# EAGLE design ElectronOnAStick-V1 (EAGLE 7.4.0)
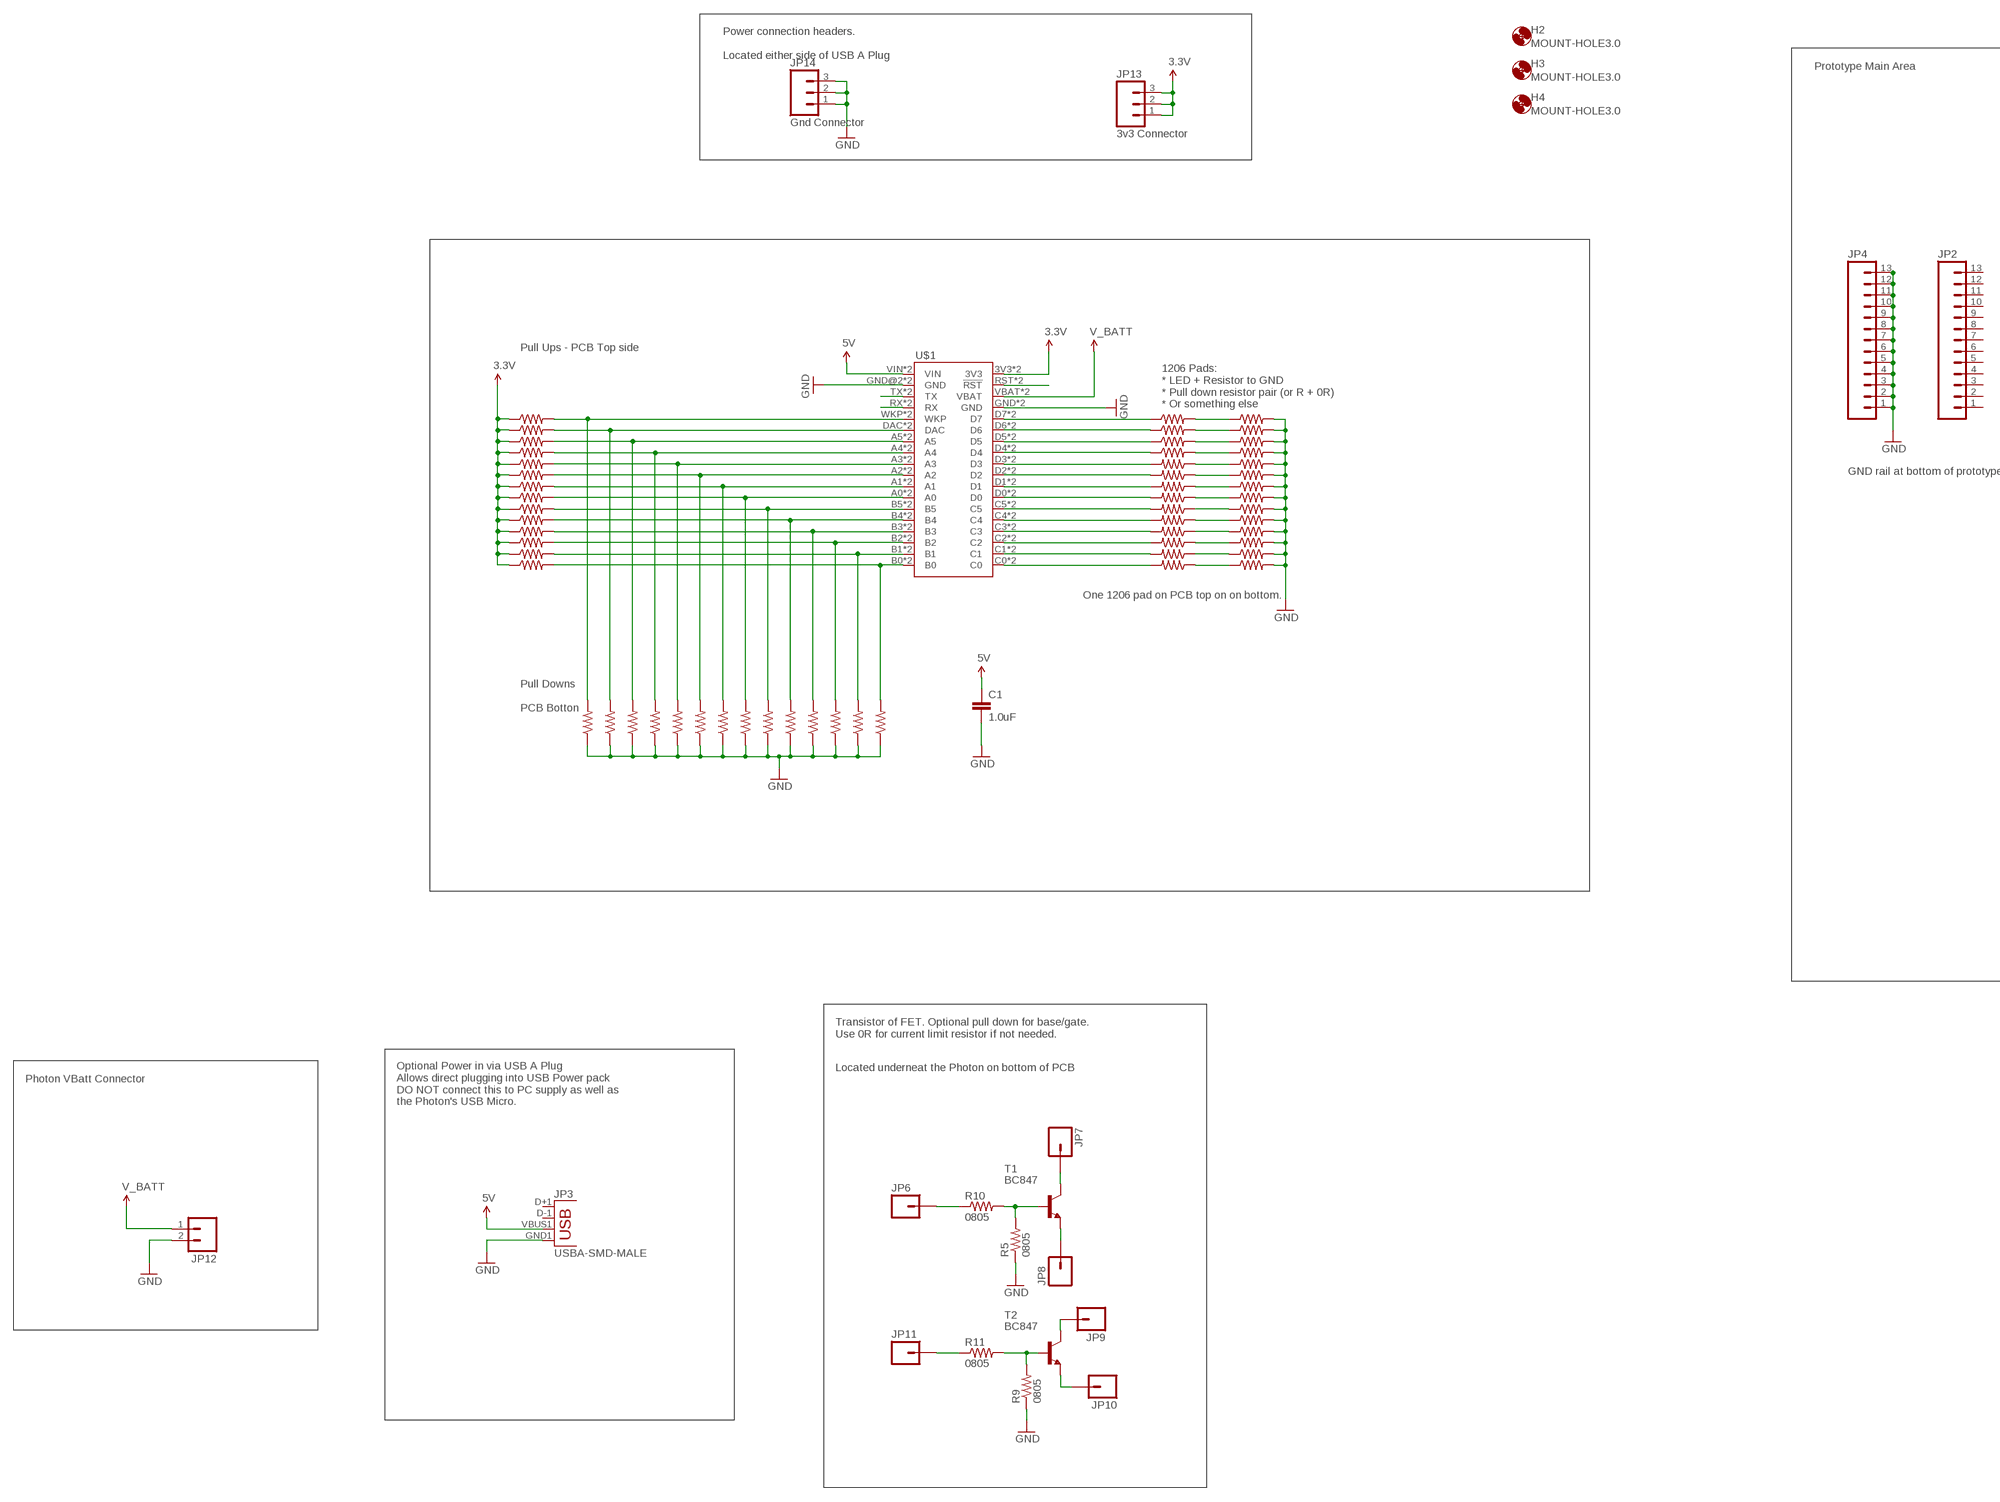
[diagram p0: schematic, sheet 1, part 1 of 2]
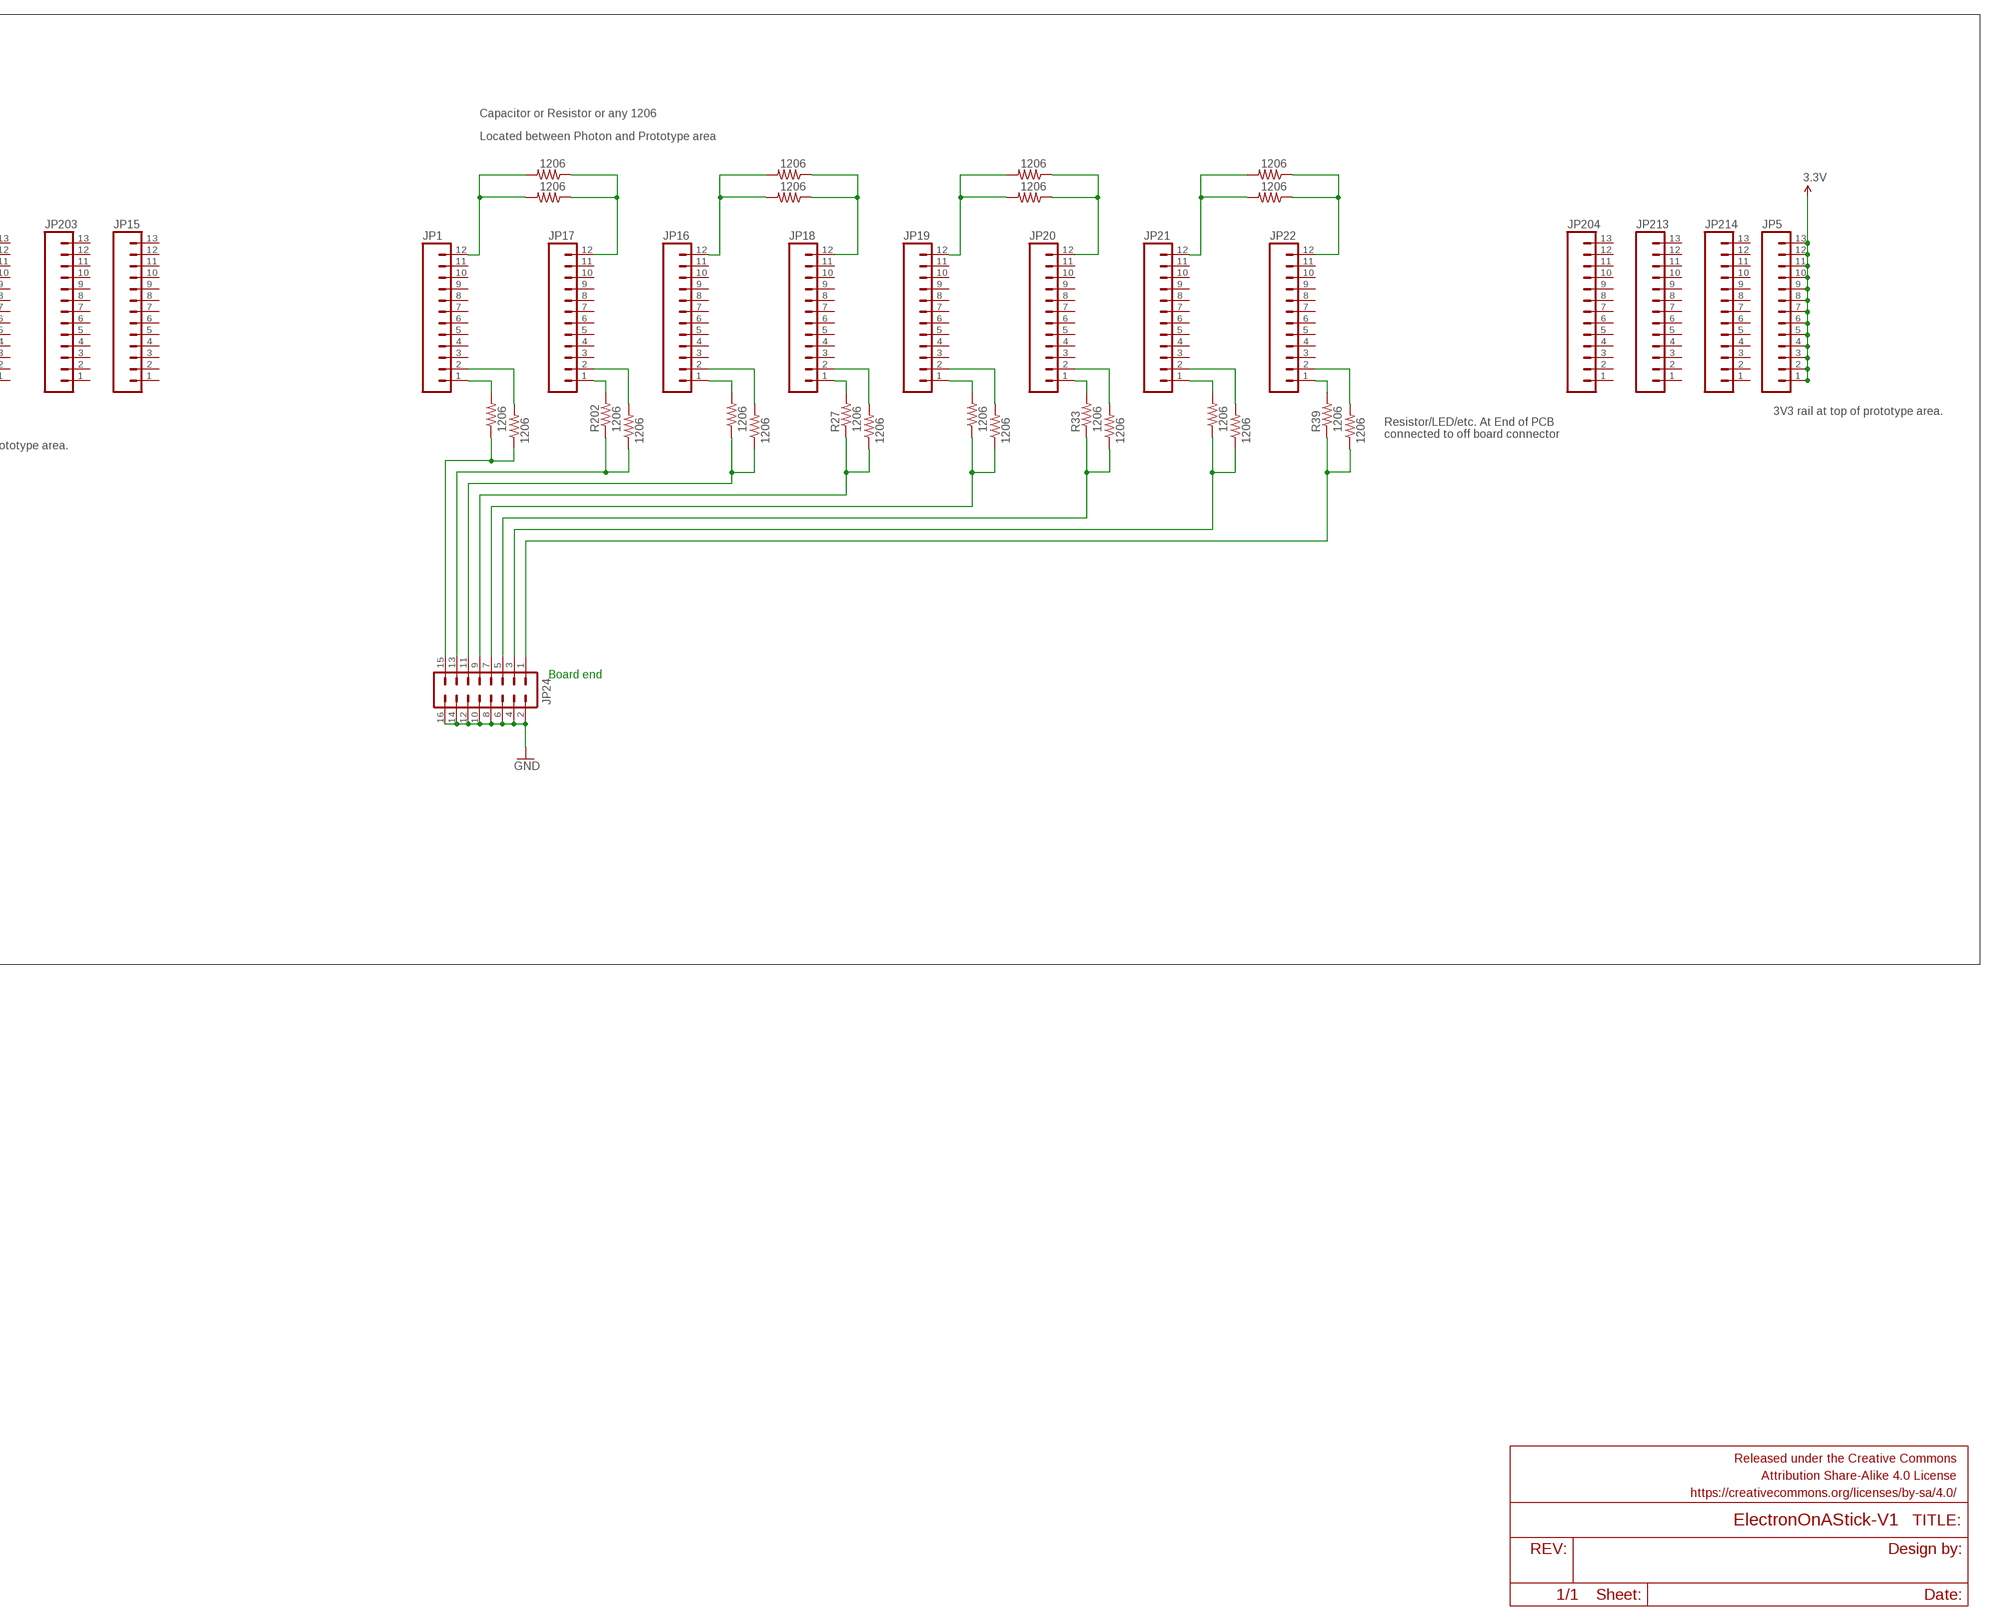
[diagram p1: schematic, sheet 1, part 2 of 2]

## Parts
C1  1.0uF  1.0UF-25V-+80/-20(0805)"  [0805-CAP]
FRAME1  FRAME-LEDGER  [CREATIVE_COMMONS]
H2  MOUNT-HOLE3.0  [3,0]
H3  MOUNT-HOLE3.0  [3,0]
H4  MOUNT-HOLE3.0  [3,0]
JP1  M12PTH  [1X12]
JP2  M13  [1X13]
JP3  USBA-SMD-MALE  [USB-A-SMT-MALE]
JP4  M13  [1X13]
JP5  M13  [1X13]
JP6  M01PTH  [1X01]
JP7  M01PTH  [1X01]
JP8  M01PTH  [1X01]
JP9  M01PTH  [1X01]
JP10  M01PTH  [1X01]
JP11  M01PTH  [1X01]
JP12  M02JST-PTH-2  [JST-2-PTH]
JP13  3v3 Connector  M03PTH  [1X03]
JP14  Gnd Connector  M03PTH  [1X03]
JP15  M13  [1X13]
JP16  M12PTH  [1X12]
JP17  M12PTH  [1X12]
JP18  M12PTH  [1X12]
JP19  M12PTH  [1X12]
JP20  M12PTH  [1X12]
JP21  M12PTH  [1X12]
JP22  M12PTH  [1X12]
JP24  M08X2  [2X8]
JP203  M13  [1X13]
JP204  M13  [1X13]
JP213  M13  [1X13]
JP214  M13  [1X13]
R1  1206  RESISTOR1206  [1206]
R2  1206  RESISTOR1206  [1206]
R3  1206  RESISTOR1206  [1206]
R4  1206  RESISTOR1206  [1206]
R5  0805  RESISTOR0805-RES  [0805]
R6  1206  RESISTOR1206  [1206]
R7  1206  RESISTOR1206  [1206]
R8  1206  RESISTOR1206  [1206]
R9  0805  RESISTOR0805-RES  [0805]
R10  0805  RESISTOR0805-RES  [0805]
R11  0805  RESISTOR0805-RES  [0805]
R12  1206  RESISTOR1206  [1206]
R13  1206  RESISTOR1206  [1206]
R14  1206  RESISTOR1206  [1206]
R15  1206  RESISTOR1206  [1206]
R16  1206  RESISTOR1206  [1206]
R17  1206  RESISTOR1206  [1206]
R18  1206  RESISTOR1206  [1206]
R19  1206  RESISTOR1206  [1206]
R20  1206  RESISTOR1206  [1206]
R21  1206  RESISTOR1206  [1206]
R22  1206  RESISTOR1206  [1206]
R23  1206  RESISTOR1206  [1206]
R24  1206  RESISTOR1206  [1206]
R25  1206  RESISTOR1206  [1206]
R26  1206  RESISTOR1206  [1206]
R27  1206  RESISTOR1206  [1206]
R28  1206  RESISTOR1206  [1206]
R29  1206  RESISTOR1206  [1206]
R30  1206  RESISTOR1206  [1206]
R31  1206  RESISTOR1206  [1206]
R32  1206  RESISTOR1206  [1206]
R33  1206  RESISTOR1206  [1206]
R34  1206  RESISTOR1206  [1206]
R35  1206  RESISTOR1206  [1206]
R36  1206  RESISTOR1206  [1206]
R37  1206  RESISTOR1206  [1206]
R38  1206  RESISTOR1206  [1206]
R39  1206  RESISTOR1206  [1206]
R40  1206  RESISTOR1206  [1206]
R41  1206  RESISTOR1206  [1206]
R42  1206  RESISTOR1206  [1206]
R43  1206  RESISTOR1206  [1206]
R44  1206  RESISTOR1206  [1206]
R45  1206  RESISTOR1206  [1206]
R46  1206  RESISTOR1206  [1206]
R47  1206  RESISTOR1206  [1206]
R48  1206  RESISTOR1206  [1206]
R49  1206  RESISTOR1206  [1206]
R50  1206  RESISTOR1206  [1206]
R51  1206  RESISTOR1206  [1206]
R52  1206  RESISTOR1206  [1206]
R53  1206  RESISTOR1206  [1206]
R54  1206  RESISTOR1206  [1206]
R55  1206  RESISTOR1206  [1206]
R56  1206  RESISTOR1206  [1206]
R57  1206  RESISTOR1206  [1206]
R58  1206  RESISTOR1206  [1206]
R59  1206  RESISTOR1206  [1206]
R60  1206  RESISTOR1206  [1206]
R61  1206  RESISTOR1206  [1206]
R62  1206  RESISTOR1206  [1206]
R63  1206  RESISTOR1206  [1206]
R64  1206  RESISTOR1206  [1206]
R65  1206  RESISTOR1206  [1206]
R66  1206  RESISTOR1206  [1206]
R67  1206  RESISTOR1206  [1206]
R68  1206  RESISTOR1206  [1206]
R69  1206  RESISTOR1206  [1206]
R70  1206  RESISTOR1206  [1206]
R201  1206  RESISTOR1206  [1206]
R202  1206  RESISTOR1206  [1206]
R313  1206  RESISTOR1206  [1206]
R314  1206  RESISTOR1206  [1206]
R315  1206  RESISTOR1206  [1206]
R316  1206  RESISTOR1206  [1206]
R317  1206  RESISTOR1206  [1206]
R318  1206  RESISTOR1206  [1206]
R319  1206  RESISTOR1206  [1206]
R320  1206  RESISTOR1206  [1206]
R410  1206  RESISTOR1206  [1206]
R411  1206  RESISTOR1206  [1206]
R412  1206  RESISTOR1206  [1206]
R413  1206  RESISTOR1206  [1206]
T1  BC847  [SOT23]
T2  BC847  [SOT23]
U$1  ELECTRONDUALNAMED  [ELECTRON_SIMPLE_SILK_NAMES_DUAL]

## Nets
3.3V: JP5.1 JP5.2 JP5.3 JP5.4 JP5.5 JP5.6 JP5.7 JP5.8 JP5.9 JP5.10 JP5.11 JP5.12 JP5.13 JP13.1 JP13.2 JP13.3 R1.1 R2.1 R3.1 R4.1 R6.1 R7.1 R12.1 R45.1 R46.1 R47.1 R48.1 R49.1 R67.1 R68.1 U$1.3V3 U$1.3V3_1(3V3)
5V: C1.1 JP3.VBUS1(VBUS) U$1.VIN U$1.VIN_1B(VIN)
GND: C1.2 JP3.GND1(GND) JP4.1 JP4.2 JP4.3 JP4.4 JP4.5 JP4.6 JP4.7 JP4.8 JP4.9 JP4.10 JP4.11 JP4.12 JP4.13 JP12.2 JP14.1 JP14.2 JP14.3 JP24.2 JP24.4 JP24.6 JP24.8 JP24.10 JP24.12 JP24.14 JP24.16 R5.1 R8.1 R9.1 R13.1 R14.1 R15.2 R16.2 R17.2 R18.2 R19.1 R20.1 R21.1 R22.1 R50.1 R51.1 R52.1 R53.1 R54.1 R55.2 R56.2 R57.2 R58.2 R59.2 R60.2 R69.1 R70.1 R410.2 R411.2 R412.2 R413.2 U$1.GND U$1.GND@2(GND) U$1.GND_1(GND) U$1.GND_1B(GND)
N$1: JP6.1 R10.1
N$2: JP17.1 R202.2
N$3: JP1.1 R201.2
N$4: U$1.RST(!RST) U$1.RST_1(!RST)
N$6: R8.2 R12.2 U$1.A5 U$1.A5_1(A5)
N$7: R49.2 R54.2 U$1.B0 U$1.B0_1(B0)
N$8: R1.2 R13.2 U$1.A4 U$1.A4_1(A4)
N$9: R2.2 R14.2 U$1.A3 U$1.A3_1(A3)
N$10: R48.2 R53.2 U$1.B1 U$1.B1_1(B1)
N$11: R22.2 R47.2 U$1.B2 U$1.B2_1(B2)
N$12: R320.1 U$1.D7 U$1.D7_1(D7)
N$13: R46.2 R52.2 U$1.B3 U$1.B3_1(B3)
N$14: JP24.15 R23.1 R201.1
N$15: R5.2 R10.2 T1.1(B)
N$16: R319.1 U$1.D6 U$1.D6_1(D6)
N$17: R318.1 U$1.D5 U$1.D5_1(D5)
N$18: R317.1 U$1.D4 U$1.D4_1(D4)
N$19: R316.2 U$1.D3 U$1.D3_1(D3)
N$20: R315.2 U$1.D2 U$1.D2_1(D2)
N$21: R314.2 U$1.D1 U$1.D1_1(D1)
N$22: JP1.2 R23.2
N$23: JP1.12 R24.2 R25.2
N$24: R45.2 R51.2 U$1.B4 U$1.B4_1(B4)
N$25: R320.2 R410.1
N$26: JP17.12 R24.1 R25.1
N$27: JP17.2 R26.2
N$28: JP24.13 R26.1 R202.1
N$29: JP18.1 R27.2
N$30: JP16.1 R28.2
N$31: JP24.11 R28.1 R29.1
N$32: JP16.2 R29.2
N$33: JP16.12 R30.2 R31.2
N$34: JP18.12 R30.1 R31.1
N$35: JP18.2 R32.2
N$36: JP24.9 R27.1 R32.1
N$37: JP20.1 R33.2
N$38: R7.2 R50.2 U$1.B5 U$1.B5_1(B5)
N$39: R313.2 U$1.D0 U$1.D0_1(D0)
N$40: JP19.1 R34.2
N$41: JP7.1 T1.3(C)
N$43: JP24.7 R34.1 R35.1
N$44: R18.1 R313.1
N$45: R17.1 R314.1
N$46: R16.1 R315.1
N$47: R15.1 R316.1
N$48: R317.2 R413.1
N$49: R318.2 R412.1
N$50: R319.2 R411.1
N$52: JP19.2 R35.2
N$53: JP19.12 R36.2 R37.2
N$54: JP20.12 R36.1 R37.1
N$55: JP8.1 T1.2(E)
N$56: JP20.2 R38.2
N$57: JP24.5 R33.1 R38.1
N$58: JP22.1 R39.2
N$59: JP11.1 R11.1
N$60: R9.2 R11.2 T2.1(B)
N$61: JP9.1 T2.3(C)
N$62: JP10.1 T2.2(E)
N$63: JP21.1 R40.2
N$64: JP24.3 R40.1 R41.1
N$65: JP21.2 R41.2
N$68: JP21.12 R42.2 R43.2
N$69: JP22.12 R42.1 R43.1
N$70: JP22.2 R44.2
N$72: JP24.1 R39.1 R44.1
N$73: R6.2 R21.2 U$1.A0 U$1.A0_1(A0)
N$74: R4.2 R20.2 U$1.A1 U$1.A1_1(A1)
N$75: R3.2 R19.2 U$1.A2 U$1.A2_1(A2)
N$76: R55.1 R61.1
N$77: R56.1 R62.1
N$78: R57.1 R63.1
N$79: R58.1 R64.1
N$80: R59.1 R65.1
N$81: R60.1 R66.1
N$82: R61.2 U$1.C5 U$1.C5_1(C5)
N$83: R62.2 U$1.C4 U$1.C4_1(C4)
N$84: R63.2 U$1.C3 U$1.C3_1(C3)
N$85: R64.2 U$1.C2 U$1.C2_1(C2)
N$86: R65.2 U$1.C1 U$1.C1_1(C1)
N$87: R66.2 U$1.C0 U$1.C0_1(C0)
N$89: U$1.TX U$1.TX_1(TX)
N$91: U$1.RX U$1.RX_1(RX)
N$92: R68.2 R70.2 U$1.WKP U$1.WKP_1(WKP)
N$93: R67.2 R69.2 U$1.DAC U$1.DAC_1(DAC)
V_BATT: JP12.1 U$1.VBAT U$1.VBATT_1(VBAT)
Unconnected: JP1.3 JP1.4 JP1.5 JP1.6 JP1.7 JP1.8 JP1.9 JP1.10 JP1.11 JP2.1 JP2.2 JP2.3 JP2.4 JP2.5 JP2.6 JP2.7 JP2.8 JP2.9 JP2.10 JP2.11 JP2.12 JP2.13 JP3.D+1(D+) JP3.D-1(D-) JP15.1 JP15.2 JP15.3 JP15.4 JP15.5 JP15.6 JP15.7 JP15.8 JP15.9 JP15.10 JP15.11 JP15.12 JP15.13 JP16.3 JP16.4 JP16.5 JP16.6 JP16.7 JP16.8 JP16.9 JP16.10 JP16.11 JP17.3 JP17.4 JP17.5 JP17.6 JP17.7 JP17.8 JP17.9 JP17.10 JP17.11 JP18.3 JP18.4 JP18.5 JP18.6 JP18.7 JP18.8 JP18.9 JP18.10 JP18.11 JP19.3 JP19.4 JP19.5 JP19.6 JP19.7 JP19.8 JP19.9 JP19.10 JP19.11 JP20.3 JP20.4 JP20.5 JP20.6 JP20.7 JP20.8 JP20.9 JP20.10 JP20.11 JP21.3 JP21.4 JP21.5 JP21.6 JP21.7 JP21.8 JP21.9 JP21.10 JP21.11 JP22.3 JP22.4 JP22.5 JP22.6 JP22.7 JP22.8 JP22.9 JP22.10 JP22.11 JP203.1 JP203.2 JP203.3 JP203.4 JP203.5 JP203.6 JP203.7 JP203.8 JP203.9 JP203.10 JP203.11 JP203.12 JP203.13 JP204.1 JP204.2 JP204.3 JP204.4 JP204.5 JP204.6 JP204.7 JP204.8 JP204.9 JP204.10 JP204.11 JP204.12 JP204.13 JP213.1 JP213.2 JP213.3 JP213.4 JP213.5 JP213.6 JP213.7 JP213.8 JP213.9 JP213.10 JP213.11 JP213.12 JP213.13 JP214.1 JP214.2 JP214.3 JP214.4 JP214.5 JP214.6 JP214.7 JP214.8 JP214.9 JP214.10 JP214.11 JP214.12 JP214.13

## Notes on the sheet
- Power connection headers.
  
  Located either side of USB A Plug
- Prototype Main Area
- Capacitor or Resistor or any 1206
- Located between Photon and Prototype area
- Pull Ups - PCB Top side
- 1206 Pads:
  * LED + Resistor to GND
  * Pull down resistor pair (or R + 0R)
  * Or something else
- 3V3 rail at top of prototype area.
- Resistor/LED/etc. At End of PCB 
  connected to off board connector
- GND rail at bottom of prototype area.
- One 1206 pad on PCB top on on bottom.
- Board end
- Pull Downs
  
  PCB Botton
- Transistor of FET. Optional pull down for base/gate.
  Use 0R for current limit resistor if not needed.
- Located underneat the Photon on bottom of PCB
- Photon VBatt Connector
- Optional Power in via USB A Plug
  Allows direct plugging into USB Power pack
  DO NOT connect this to PC supply as well as
  the Photon's USB Micro.

## Library data of the parts
C1 = SparkFun-Capacitors:1.0UF-25V-+80/-20(0805): CAP-11625; PROD_ID: CAP-11625
FRAME1 = SparkFun-Aesthetics:FRAME-LEDGER: Schematic Frame Standard 11x14 US Ledger frame
H2-H4 = holes:MOUNT-HOLE: MOUNTING HOLE with drill center marker
JP1 JP16-JP22 = SparkFun-Connectors:M12: Header 12 Standard 12-pin 0.1" header. Use with straight break away headers (SKU : PRT-00116), right angle break away headers (PRT-00553), swiss pins (PRT-00743), machine pins (PRT-00117), and female headers (PRT-00115).
JP2 JP4 JP5 JP15 JP203 JP204 JP213 JP214 = SparkFun-Connectors:M13: 13-pin single row .1" header
JP3 = SparkFun-Connectors:USB: USB Connectors USB-B-PTH is fully proven SKU : PRT-00139/CONN-08278 USB-miniB is fully proven SKU : PRT-00587 USB-A-PCB is untested. USB-A-H is throughly reviewed, but untested. Spark Fun Electronics SKU : PRT-00437 USB-B-SMT is throughly reviewed, but untested. Needs silkscreen touching up. USB-A-S has not been used/tested USB-MB-H has not been used/tested USB-MICROB has been used. CONN-09505
JP6-JP11 = SparkFun-Connectors:M01: Header 1 Standard 1-pin 0.1" header. Use with straight break away headers (SKU : PRT-00116), right angle break away headers (PRT-00553), swiss pins (PRT-00743), machine pins (PRT-00117), and female headers (PRT-00115).
JP12 = SparkFun-Connectors:M02: Standard 2-pin 0.1" header. Use with - straight break away headers ( PRT-00116) - right angle break away headers (PRT-00553) - swiss pins (PRT-00743) - machine pins (PRT-00117) - female headers (PRT-00115) Molex polarized connector foot print use with: PRT-08233 with associated crimp pins and housings. 2.54_SCREWTERM for use with PRT-10571. 3.5mm Screw Terminal footprints for PRT-08084 5mm Screw Terminal footprints for use with PRT-08432; PROD_ID: CONN-09863; SKU: PRT-09914
JP13 JP14 = SparkFun-Connectors:M03: Header 3 Standard 3-pin 0.1" header. Use with straight break away headers (SKU : PRT-00116), right angle break away headers (PRT-00553), swiss pins (PRT-00743), machine pins (PRT-00117), and female headers (PRT-00115). Molex polarized connector foot print use with SKU : PRT-08232 with associated crimp pins and housings.
JP24 = SparkFun-Connectors:M08X2: .1" headers, two rows of 8 each
R1-R70 R201 R202 R313-R320 R410-R413 = SparkFun-Resistors:RESISTOR: Resistor Basic schematic elements and footprints for 0603, 1206, and PTH resistors.
T1 T2 = transistor-neu-to92:BC847: NPN TRANSISTOR
U$1 = Tinamous:ELECTRON

## Board
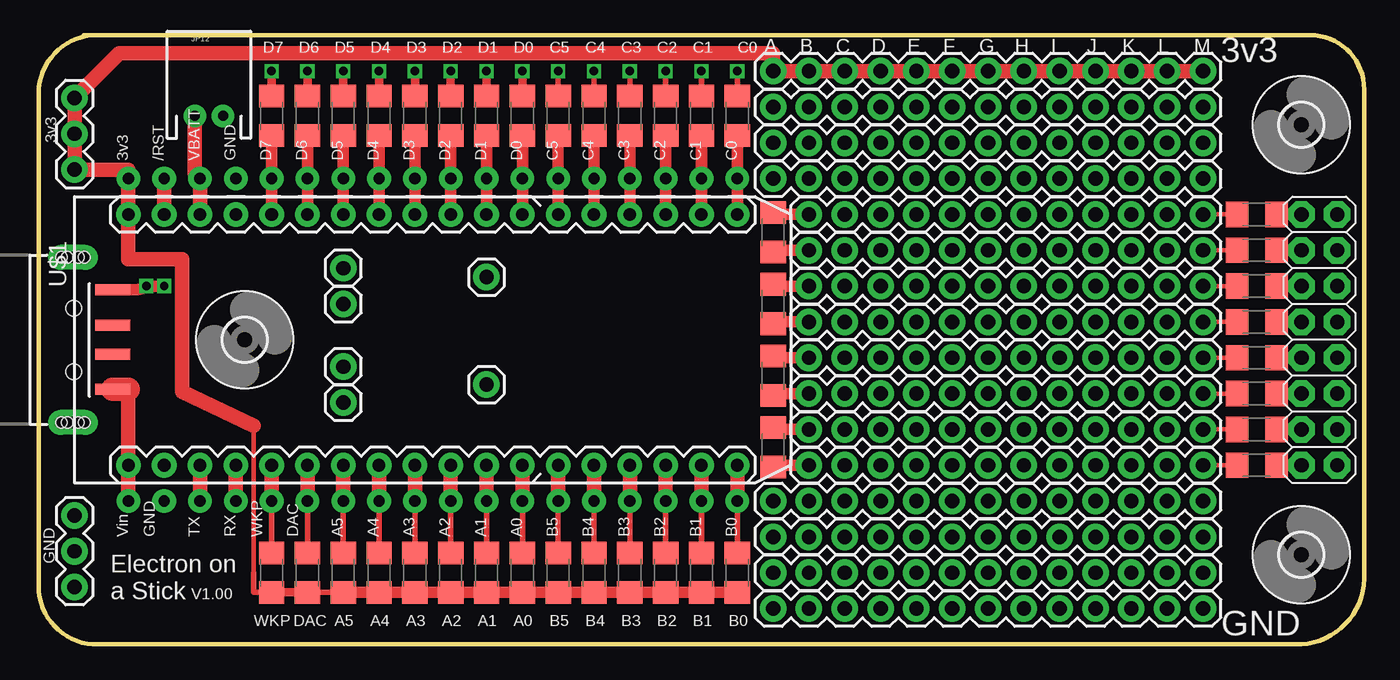
[diagram p2: board, top side]
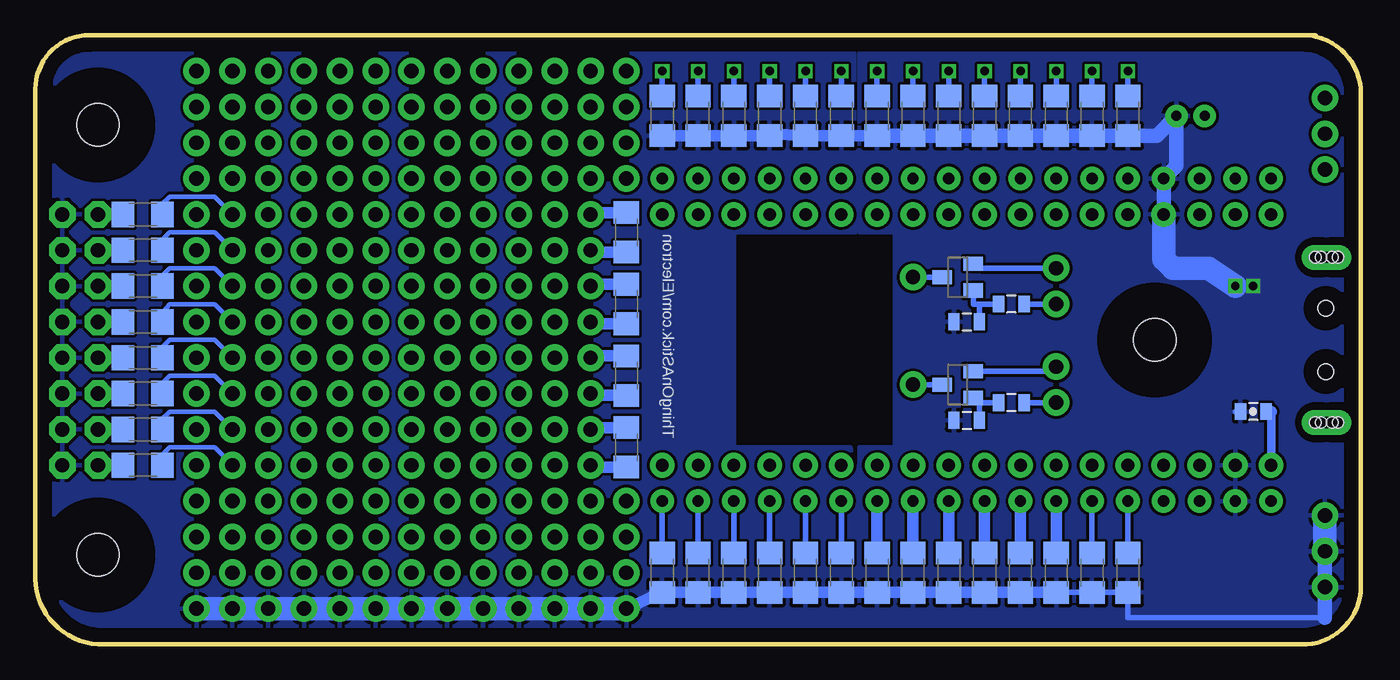
[diagram p3: board, bottom side, seen from below]

Size 94 x 43.18 mm. Coordinates in mm from the lower left corner, seen from the top.
Outline: 0.01,4.45 arc90 3.82,0 89.55,0 arc90 93.99,5.08 93.99,39.37 arc90 90.18,43.18 3.19,43.18
Outline: 0.01,4.06 0.01,38.73 arc-90 3.82,43.18
Copper layers (1*16): Top 0.035mm / dielectric 1.5mm / Bottom 0.035mm
Design rules "default": minimum track width 10mil, minimum drill 24mil, track to track 8mil, track to pad 8mil, pad to pad 8mil, via to via 8mil, smd to smd 8mil, copper to edge 40mil, drill to drill 8mil, minimum pad ring 10mil, minimum via ring 8mil, stop-mask expansion 4mil, vias tented up to drill 0mil, thermal gap 10mil

### Footprints (pad centres in the part's own frame; a part is rotated, then mirrored left to right if it is on the bottom)
0805-CAP = smd 0.8 x 1.2: 1 -0.9,0; 2 0.9,0
3,0 = hole 3: 0,0
1X12 = drill 1.016 pad 1.88: 1 0,0; 2 2.54,0; 3 5.08,0; 4 7.62,0; 5 10.16,0; 6 12.7,0; 7 15.24,0; 8 17.78,0; 9 20.32,0; 10 22.86,0; 11 25.4,0; 12 27.94,0
1X13 = drill 1.016 pad 1.88: 1 0,0; 2 2.54,0; 3 5.08,0; 4 7.62,0; 5 10.16,0; 6 12.7,0; 7 15.24,0; 8 17.78,0; 9 20.32,0; 10 22.86,0; 11 25.4,0; 12 27.94,0; 13 30.48,0
USB-A-SMT-MALE = smd 0.8 x 2.5: D+1 1.027,-5.87; D-1 -1.027,-5.87; GND1 3.551,-5.87; VBUS1 -3.5,-5.87 | drill 0.8 pad 1.778 long: P$1 5.85,-3.05; P$3 -5.85,-3.05 | hole 1.1: 2.25,-3.12; -2.25,-3.12 | hole 0.8: -5.85,-3.45; -5.85,-3.85; -5.85,-2.65; -5.85,-2.25; 5.85,-3.45; 5.85,-3.85; 5.85,-2.65; 5.85,-2.25
1X01 = drill 1.016 pad 1.88: 1 0,0
JST-2-PTH = drill 0.7 pad 1.6: 1 -1,0; 2 1,0
1X03 = drill 1.016 pad 1.88: 1 0,0; 2 2.54,0; 3 5.08,0
2X8 = drill 1.016 pad 1.88 octagon: 1 0,0; 2 0,2.54; 3 2.54,0; 4 2.54,2.54; 5 5.08,0; 6 5.08,2.54; 7 7.62,0; 8 7.62,2.54; 9 10.16,0; 10 10.16,2.54; 11 12.7,0; 12 12.7,2.54; 13 15.24,0; 14 15.24,2.54; 15 17.78,0; 16 17.78,2.54
1206 = smd 1.6 x 1.8: 1 -1.4,0; 2 1.4,0
0805 = smd 0.8 x 1.2: 1 -0.9,0; 2 0.9,0
SOT23 = smd 1 x 1.4: 1 -0.95,-1.1; 2 0.95,-1.1; 3 0,1.1
ELECTRON_SIMPLE_SILK_NAMES_DUAL = drill 0.889 pad 1.753: 3V3 1.27,22.86; A0 29.21,5.08; A1 26.67,5.08; A2 24.13,5.08; A3 21.59,5.08; A4 19.05,5.08; A5 16.51,5.08; B0 44.45,5.08; B1 41.91,5.08; B2 39.37,5.08; B3 36.83,5.08; B4 34.29,5.08; B5 31.75,5.08; C0 44.45,22.86; C1 41.91,22.86; C2 39.37,22.86; C3 36.83,22.86; C4 34.29,22.86; C5 31.75,22.86; D0 29.21,22.86; D1 26.67,22.86; D2 24.13,22.86; D3 21.59,22.86; D4 19.05,22.86; D5 16.51,22.86; D6 13.97,22.86; D7 11.43,22.86; DAC 13.97,5.08; GND 8.89,22.86; GND@2 3.81,5.08; RST 3.81,22.86; RX 8.89,5.08; TX 6.35,5.08; VBAT 6.35,22.86; VIN 1.27,5.08; WKP 11.43,5.08 | drill 0.8 pad 1.676: 3V3_1 1.27,25.4; A0_1 29.21,2.54; A1_1 26.67,2.54; A2_1 24.13,2.54; A3_1 21.59,2.54; A4_1 19.05,2.54; A5_1 16.51,2.54; B0_1 44.45,2.54; B1_1 41.91,2.54; B2_1 39.37,2.54; B3_1 36.83,2.54; B4_1 34.29,2.54; B5_1 31.75,2.54; C0_1 44.45,25.4; C1_1 41.91,25.4; C2_1 39.37,25.4; C3_1 36.83,25.4; C4_1 34.29,25.4; C5_1 31.75,25.4; D0_1 29.21,25.4; D1_1 26.67,25.4; D2_1 24.13,25.4; D3_1 21.59,25.4; D4_1 19.05,25.4; D5_1 16.51,25.4; D6_1 13.97,25.4; D7_1 11.43,25.4; DAC_1 13.97,2.54; GND_1 8.89,25.4; GND_1B 3.81,2.54; RST_1 3.81,25.4; RX_1 8.89,2.54; TX_1 6.35,2.54; VBATT_1 6.35,25.4; VIN_1B 1.27,2.54; WKP_1 11.43,2.54

### Placement (x,y rotation side)
C1  7.63,16.51 180 bottom
FRAME1  -5.07,-8.25 0 top  (outside the outline)
H2  14.62,21.59 0 top
H3  89.55,36.83 0 top
H4  89.55,6.35 0 top
JP1  82.56,12.7 180 top
JP2  82.56,38.1 180 top
JP3  -0.62,21.59 90 top
JP4  82.56,2.54 180 top
JP5  82.56,40.64 180 top
JP6  21.6,24.13 0 top
JP7  31.76,26.04 0 top
JP8  21.6,26.67 0 top
JP9  31.76,18.41 0 top
JP10  21.6,19.68 0 top
JP11  21.6,17.14 0 top
JP12  12.08,37.46 0 top
JP13  2.55,33.66 90 top
JP14  2.55,9.14 270 top
JP15  82.56,5.08 180 top
JP16  82.56,17.78 180 top
JP17  82.56,15.24 180 top
JP18  82.56,20.32 180 top
JP19  82.56,22.86 180 top
JP20  82.56,25.4 180 top
JP21  82.56,27.94 180 top
JP22  82.56,30.48 180 top
JP24  89.55,30.48 270 top
JP203  82.56,35.56 180 top
JP204  82.56,33.02 180 top
JP213  82.56,10.16 180 top
JP214  82.56,7.62 180 top
R1  24.14,5.08 90 top
R2  26.68,5.08 90 top
R3  29.22,5.08 90 top
R4  31.76,5.08 90 top
R5  27.95,22.86 0 bottom
R6  34.3,5.08 90 top
R7  36.84,5.08 90 top
R8  21.6,5.08 90 bottom
R9  27.95,15.88 0 bottom
R10  24.78,24.13 180 bottom
R11  24.78,17.14 180 bottom
R12  21.6,5.08 90 top
R13  24.14,5.08 90 bottom
R14  26.68,5.08 90 bottom
R15  26.68,37.46 270 bottom
R16  29.22,37.46 270 bottom
R17  31.76,37.46 270 bottom
R18  34.3,37.46 270 bottom
R19  29.22,5.08 90 bottom
R20  31.76,5.08 90 bottom
R21  34.3,5.08 90 bottom
R22  44.46,5.08 90 bottom
R23  86.37,12.7 0 bottom
R24  52.08,13.97 270 top
R25  52.08,13.97 270 bottom
R26  86.37,15.24 0 bottom
R27  86.37,20.32 180 top
R28  86.37,17.78 180 top
R29  86.37,17.78 0 bottom
R30  52.08,19.05 270 top
R31  52.08,19.05 270 bottom
R32  86.37,20.32 0 bottom
R33  86.37,25.4 180 top
R34  86.37,22.86 180 top
R35  86.37,22.86 0 bottom
R36  52.08,24.13 270 top
R37  52.08,24.13 270 bottom
R38  86.37,25.4 0 bottom
R39  86.37,30.48 180 top
R40  86.37,27.94 180 top
R41  86.37,27.94 0 bottom
R42  52.08,29.21 270 top
R43  52.08,29.21 270 bottom
R44  86.37,30.48 0 bottom
R45  39.38,5.08 90 top
R46  41.92,5.08 90 top
R47  44.46,5.08 90 top
R48  47,5.08 90 top
R49  49.54,5.08 90 top
R50  36.84,5.08 90 bottom
R51  39.38,5.08 90 bottom
R52  41.92,5.08 90 bottom
R53  47,5.08 90 bottom
R54  49.54,5.08 90 bottom
R55  36.84,37.46 270 bottom
R56  39.38,37.46 270 bottom
R57  41.92,37.46 270 bottom
R58  44.46,37.46 270 bottom
R59  47,37.46 270 bottom
R60  49.54,37.46 270 bottom
R61  36.84,37.46 270 top
R62  39.38,37.46 270 top
R63  41.92,37.46 270 top
R64  44.46,37.46 270 top
R65  47,37.46 270 top
R66  49.54,37.46 270 top
R67  19.06,5.08 90 top
R68  16.52,5.08 90 top
R69  19.06,5.08 90 bottom
R70  16.52,5.08 90 bottom
R201  86.37,12.7 180 top
R202  86.37,15.24 180 top
R313  34.3,37.46 270 top
R314  31.76,37.46 270 top
R315  29.22,37.46 270 top
R316  26.68,37.46 270 top
R317  24.14,37.46 90 top
R318  21.6,37.46 90 top
R319  19.06,37.46 90 top
R320  16.52,37.46 90 top
R410  16.52,37.46 270 bottom
R411  19.06,37.46 270 bottom
R412  21.6,37.46 270 bottom
R413  24.14,37.46 270 bottom
T1  28.59,26.04 90 bottom
T2  28.59,18.41 90 bottom
U$1  5.09,7.62 0 top

### Tracks (layer width: path | path; a pad name or v marks a point on that pad's centre or on a via)
3.3V
  Top 0.305: 15.25,4.18 15.25,5.08 15.25,15.49
  Top 0.406: R12.1 R67.1 | R68.1 15.25,3.68 15.25,5.08
  Top 0.61: R68.1 R67.1
  Top 0.813: R12.1 R1.1 R2.1 R3.1 R4.1 R6.1 R7.1 R45.1 R46.1 R47.1 R48.1 R49.1
  Top 1.016: 15.25,15.49 10.17,17.91 10.17,27.3 6.36,27.3 U$1.3V3 U$1.3V3_1 6.36,33.66 JP13.1 JP13.2 JP13.3 5.73,41.91 52.08,41.91 JP5.13 JP5.12 JP5.11 JP5.10 JP5.9 JP5.8 JP5.7 JP5.6 JP5.5 JP5.4 JP5.3 JP5.2 JP5.1
5V
  Top 1.016: U$1.VIN_1B U$1.VIN 6.36,18.09
  Top 1.676: JP3.VBUS1 6.36,18.09
  Bottom 0.61: 6.36,16.51 U$1.VIN
  Bottom 0.813: C1.1 6.36,16.51
GND  (via drill 0.6)
  Top 0.813: JP3.GND1 7,25.14 7,25.15 7.89,25.4 v8.9,25.4
  Bottom 0.406: C1.2 8.9,16.51 | 2.55,1.91 16.52,1.91 R70.1 R8.1
  Bottom 0.813: R8.1 R13.1 R14.1 R19.1 R20.1 R21.1 R50.1 R51.1 R52.1 R22.1 R53.1 R54.1 JP4.13 | R60.2 R59.2 R58.2 R57.2 41.92,36.2 R56.2 R55.2 R18.2
  Bottom 1.016: R18.2 R17.2 R16.2 R15.2 R413.2 R412.2 R411.2 R410.2 14.48,36.06 JP12.2 13.08,33.93 U$1.GND_1 13.98,30.35 | JP14.2 2.55,1.91
  Bottom 1.676: JP4.1 JP4.2 JP4.3 JP4.4 JP4.5 JP4.6 JP4.7 JP4.8 JP4.9 JP4.10 JP4.11 JP4.12 JP4.13 | 13.98,30.35 13.98,27.3 13.35,26.67 10.81,26.67 v8.9,25.4 | JP14.1 JP14.2
  other vias: 7.63,25.4
  pour Bottom: -3.16,-0.63 94.63,-0.63 95.26,44.45 35.95,44.45 35.83,29.21 44.46,29.21 44.46,13.97 36.21,13.97 35.57,11.43 35.57,13.97 33.03,13.97 33.03,29.21 35.57,29.21 35.57,44.45 -2.53,44.45
N$1
  Bottom 0.406: R10.1 JP6.1
N$2
  Top 0.305: R202.2 JP17.1
N$3
  Top 0.305: R201.2 JP1.1
N$4
  Top 1.016: U$1.RST U$1.RST_1
N$6
  Top 0.406: U$1.A5_1 R8.2
  Top 1.016: U$1.A5 U$1.A5_1
  Bottom 0.813: R8.2 U$1.A5_1
N$7
  Top 0.406: R54.2 U$1.B0_1
  Top 1.016: U$1.B0 U$1.B0_1
  Bottom 0.406: R54.2 U$1.B0_1
N$8
  Top 0.406: U$1.A4_1 R13.2
  Top 1.016: U$1.A4 U$1.A4_1
  Bottom 0.813: R13.2 U$1.A4_1
N$9
  Top 0.406: U$1.A3_1 R14.2
  Top 1.016: U$1.A3 U$1.A3_1
  Bottom 0.813: R14.2 U$1.A3_1
N$10
  Top 0.406: R53.2 U$1.B1_1
  Top 1.016: U$1.B1 U$1.B1_1
  Bottom 0.406: R53.2 U$1.B1_1
N$11
  Top 0.406: R22.2 U$1.B2_1
  Top 1.016: U$1.B2 U$1.B2_1
  Bottom 0.406: R22.2 U$1.B2_1
N$12
  Top 0.813: U$1.D7 U$1.D7_1 R320.1
N$13
  Top 0.406: R52.2 U$1.B3_1
  Top 1.016: U$1.B3 U$1.B3_1
  Bottom 0.406: R52.2 U$1.B3_1
N$14
  Top 0.305: R23.1 JP24.15
  Bottom 0.305: R23.1 JP24.15
N$15
  Bottom 0.406: R10.2 27.05,24.13 | T1.1 27.49,24.13 27.05,24.13 | 27.05,24.13 R5.2
N$16
  Top 0.813: R319.1 U$1.D6_1 U$1.D6
N$17
  Top 0.813: U$1.D5 U$1.D5_1 R318.1
N$18
  Top 0.813: R317.1 U$1.D4_1 U$1.D4
N$19
  Top 0.813: U$1.D3 U$1.D3_1 R316.2
N$20
  Top 0.813: R315.2 U$1.D2_1 U$1.D2
N$21
  Top 0.813: U$1.D1 U$1.D1_1 R314.2
N$22
  Bottom 0.305: JP1.2 81.29,13.97 84.47,13.97 85.1,13.34 85.1,12.83 R23.2
N$23
  Top 0.813: JP1.12 52.08,12.7 R25.2
  Bottom 0.813: R25.2 54.62,12.57 JP1.12
N$24
  Top 0.406: R51.2 U$1.B4_1
  Top 1.016: U$1.B4 U$1.B4_1
  Bottom 0.406: R51.2 U$1.B4_1
N$25  (via drill 0.6)
  Top 0.61: R410.1 v16.52,40.64
  Bottom 0.406: R410.1 v16.52,40.64
N$26
  Top 0.813: JP17.12 52.08,15.24 R25.1
  Bottom 0.813: R25.1 54.62,15.37 JP17.12
N$27
  Bottom 0.305: JP17.2 81.29,16.51 84.47,16.51 85.1,15.88 85.1,15.37 R26.2
N$28
  Top 0.305: R26.1 JP24.13
  Bottom 0.305: R26.1 JP24.13
N$29
  Top 0.305: R27.2 JP18.1
N$30
  Top 0.305: R28.2 JP16.1
N$31
  Top 0.305: R29.1 JP24.11
  Bottom 0.305: JP24.11 R29.1
N$32
  Bottom 0.305: JP16.2 81.29,19.05 84.47,19.05 85.1,18.41 85.1,17.91 R29.2
N$33
  Top 0.813: JP16.12 52.08,17.78 R31.2
  Bottom 0.813: R31.2 54.62,17.65 JP16.12
N$34
  Top 0.813: JP18.12 52.08,20.32 R31.1
  Bottom 0.813: R31.1 54.62,20.45 JP18.12
N$35
  Bottom 0.305: JP18.2 81.29,21.59 84.47,21.59 85.1,20.95 85.1,20.45 R32.2
N$36
  Top 0.305: R32.1 JP24.9
  Bottom 0.305: R32.1 JP24.9
N$37
  Top 0.305: JP20.1 R33.2
N$38
  Top 0.406: R50.2 U$1.B5_1
  Top 1.016: U$1.B5 U$1.B5_1
  Bottom 0.406: R50.2 U$1.B5_1
N$39
  Top 0.813: R313.2 U$1.D0_1 U$1.D0
N$40
  Top 0.305: JP19.1 R34.2
N$41
  Bottom 0.406: T1.3 JP7.1
N$43
  Top 0.305: R35.1 JP24.7
  Bottom 0.305: R35.1 JP24.7
N$44  (via drill 0.6)
  Top 0.61: R18.1 v34.3,40.64
  Bottom 0.406: R18.1 v34.3,40.64
N$45  (via drill 0.6)
  Top 0.61: R17.1 v31.76,40.64
  Bottom 0.406: R17.1 v31.76,40.64
N$46  (via drill 0.6)
  Top 0.61: R16.1 v29.22,40.64
  Bottom 0.406: R16.1 v29.22,40.64
N$47  (via drill 0.6)
  Top 0.61: R15.1 v26.68,40.64
  Bottom 0.406: R15.1 v26.68,40.64
N$48  (via drill 0.6)
  Top 0.61: R413.1 v24.14,40.64
  Bottom 0.406: R413.1 v24.14,40.64
N$49  (via drill 0.6)
  Top 0.61: R412.1 v21.6,40.64
  Bottom 0.406: R412.1 v21.6,40.64
N$50  (via drill 0.6)
  Top 0.61: R411.1 v19.06,40.64
  Bottom 0.406: R411.1 v19.06,40.64
N$52
  Bottom 0.305: JP19.2 81.29,24.13 84.47,24.13 85.1,23.36 R35.2
N$53
  Top 0.813: JP19.12 52.08,22.86 R37.2
  Bottom 0.813: R37.2 54.62,22.73 JP19.12
N$54
  Top 0.813: JP20.12 52.08,25.4 R37.1
  Bottom 0.813: R37.1 54.62,25.53 JP20.12
N$55
  Bottom 0.406: JP8.1 26.85,26.67 T1.2
N$56
  Bottom 0.305: JP20.2 81.29,26.67 84.47,26.67 85.1,26.04 85.1,25.53 R38.2
N$57
  Top 0.305: R38.1 JP24.5
  Bottom 0.305: R38.1 JP24.5
N$58
  Top 0.305: JP22.1 R39.2
N$59
  Bottom 0.406: R11.1 JP11.1
N$60
  Bottom 0.406: R11.2 27.05,17.14 | T2.1 27.49,17.14 27.05,17.14 | 27.05,17.14 R9.2
N$61
  Bottom 0.406: T2.3 JP9.1
N$62
  Bottom 0.406: T2.2 21.6,19.36 JP10.1
N$63
  Top 0.305: JP21.1 R40.2
N$64
  Top 0.305: R41.1 JP24.3
  Bottom 0.305: 87.64,27.94 R41.1 JP24.3
N$65
  Bottom 0.305: JP21.2 81.29,29.21 84.47,29.21 85.1,28.57 85.1,28.07 R41.2
N$68
  Top 0.813: JP21.12 52.08,27.94 R43.2
  Bottom 0.813: R43.2 54.62,27.81 JP21.12
N$69
  Top 0.813: JP22.12 52.08,30.48 R43.1
  Bottom 0.813: R43.1 54.62,30.61 JP22.12
N$70
  Bottom 0.305: JP22.2 81.29,31.75 84.47,31.75 85.1,31.11 85.1,30.61 R44.2
N$72
  Top 0.305: R44.1 JP24.1
  Bottom 0.305: R44.1 JP24.1
N$73
  Top 0.406: U$1.A0_1 R21.2
  Top 1.016: U$1.A0 U$1.A0_1
  Bottom 0.813: R21.2 U$1.A0_1
N$74
  Top 0.406: U$1.A1_1 R20.2
  Top 1.016: U$1.A1 U$1.A1_1
  Bottom 0.813: R20.2 U$1.A1_1
N$75
  Top 0.406: U$1.A2_1 R19.2
  Top 1.016: U$1.A2 U$1.A2_1
  Bottom 0.813: R19.2 U$1.A2_1
N$76  (via drill 0.6)
  Top 0.406: R61.1 v36.84,40.64
  Bottom 0.406: v36.84,40.64 R61.1
N$77  (via drill 0.6)
  Top 0.406: v39.38,40.64 R56.1
  Bottom 0.406: R56.1 v39.38,40.64
N$78  (via drill 0.6)
  Top 0.406: R63.1 v41.92,40.64
  Bottom 0.406: v41.92,40.64 R63.1
N$79  (via drill 0.6)
  Top 0.406: v44.46,40.64 R58.1
  Bottom 0.406: R58.1 v44.46,40.64
N$80  (via drill 0.6)
  Top 0.406: R65.1 v47,40.64
  Bottom 0.406: v47,40.64 R65.1
N$81  (via drill 0.6)
  Top 0.406: v49.54,40.64 R60.1
  Bottom 0.406: R60.1 v49.54,40.64
N$82
  Top 0.813: U$1.C5 U$1.C5_1 R61.2
N$83
  Top 0.813: U$1.C4 U$1.C4_1 R62.2
N$84
  Top 0.813: U$1.C3 U$1.C3_1 R63.2
N$85
  Top 0.813: U$1.C2 U$1.C2_1 R64.2
N$86
  Top 0.813: U$1.C1 U$1.C1_1 R65.2
N$87
  Top 0.813: U$1.C0 U$1.C0_1 R66.2
N$89
  Top 1.016: U$1.TX U$1.TX_1
N$91
  Top 1.016: U$1.RX U$1.RX_1
N$92
  Top 0.406: U$1.WKP_1 R70.2
  Top 1.016: U$1.WKP U$1.WKP_1
  Bottom 0.406: R70.2 U$1.WKP_1
N$93
  Top 0.406: U$1.DAC_1 R69.2
  Top 1.016: U$1.DAC U$1.DAC_1
  Bottom 0.406: R69.2 U$1.DAC_1
V_BATT
  Top 1.016: U$1.VBAT U$1.VBATT_1 11.08,33.38 JP12.1

### Text on the board
tNames: D7 | D6 | D5 | D4 | D3 | D2 | D1 | D0 | C5 | C4 | C3 | C2 | C1 | C0 | A | B | C | D | E | F | G | H | I | J | K | L | M | 3v3 | 3v3 | GND | Electron on / a Stick | V1.00 | WKP | DAC | A5 | A4 | A3 | A2 | A1 | A0 | B5 | B4 | B3 | B2 | B1 | B0 | GND
bNames: ThingOnAStick.com/Electron